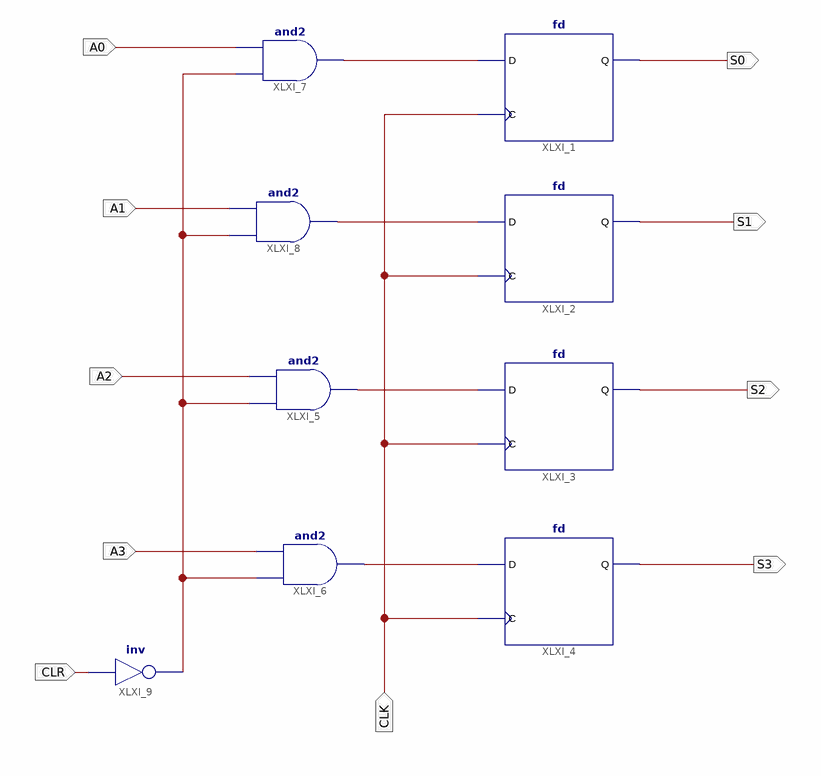
[diagram p0: schematic sheet 1]
// Xilinx ISE schematic REGISTER_4.sch (spartan3e) as structural Verilog: 9 symbols, 10 ports
module REGISTER_4 (
  input  CLK,
  input  A0,
  input  A1,
  input  A2,
  input  A3,
  input  CLR,
  output S0,
  output S1,
  output S2,
  output S3
);

  wire XLXN_10, XLXN_11, XLXN_12, XLXN_13, XLXN_14;

  fd XLXI_1 (.C(CLK), .D(XLXN_10), .Q(S0));
  fd XLXI_2 (.C(CLK), .D(XLXN_11), .Q(S1));
  fd XLXI_3 (.C(CLK), .D(XLXN_12), .Q(S2));
  fd XLXI_4 (.C(CLK), .D(XLXN_13), .Q(S3));
  and XLXI_5 (XLXN_12, XLXN_14, A2);
  and XLXI_6 (XLXN_13, XLXN_14, A3);
  and XLXI_7 (XLXN_10, XLXN_14, A0);
  and XLXI_8 (XLXN_11, XLXN_14, A1);
  not XLXI_9 (XLXN_14, CLR);
endmodule
